# EAGLE board Копия keyBoard_B (EAGLE 6.3), part 1 of 2
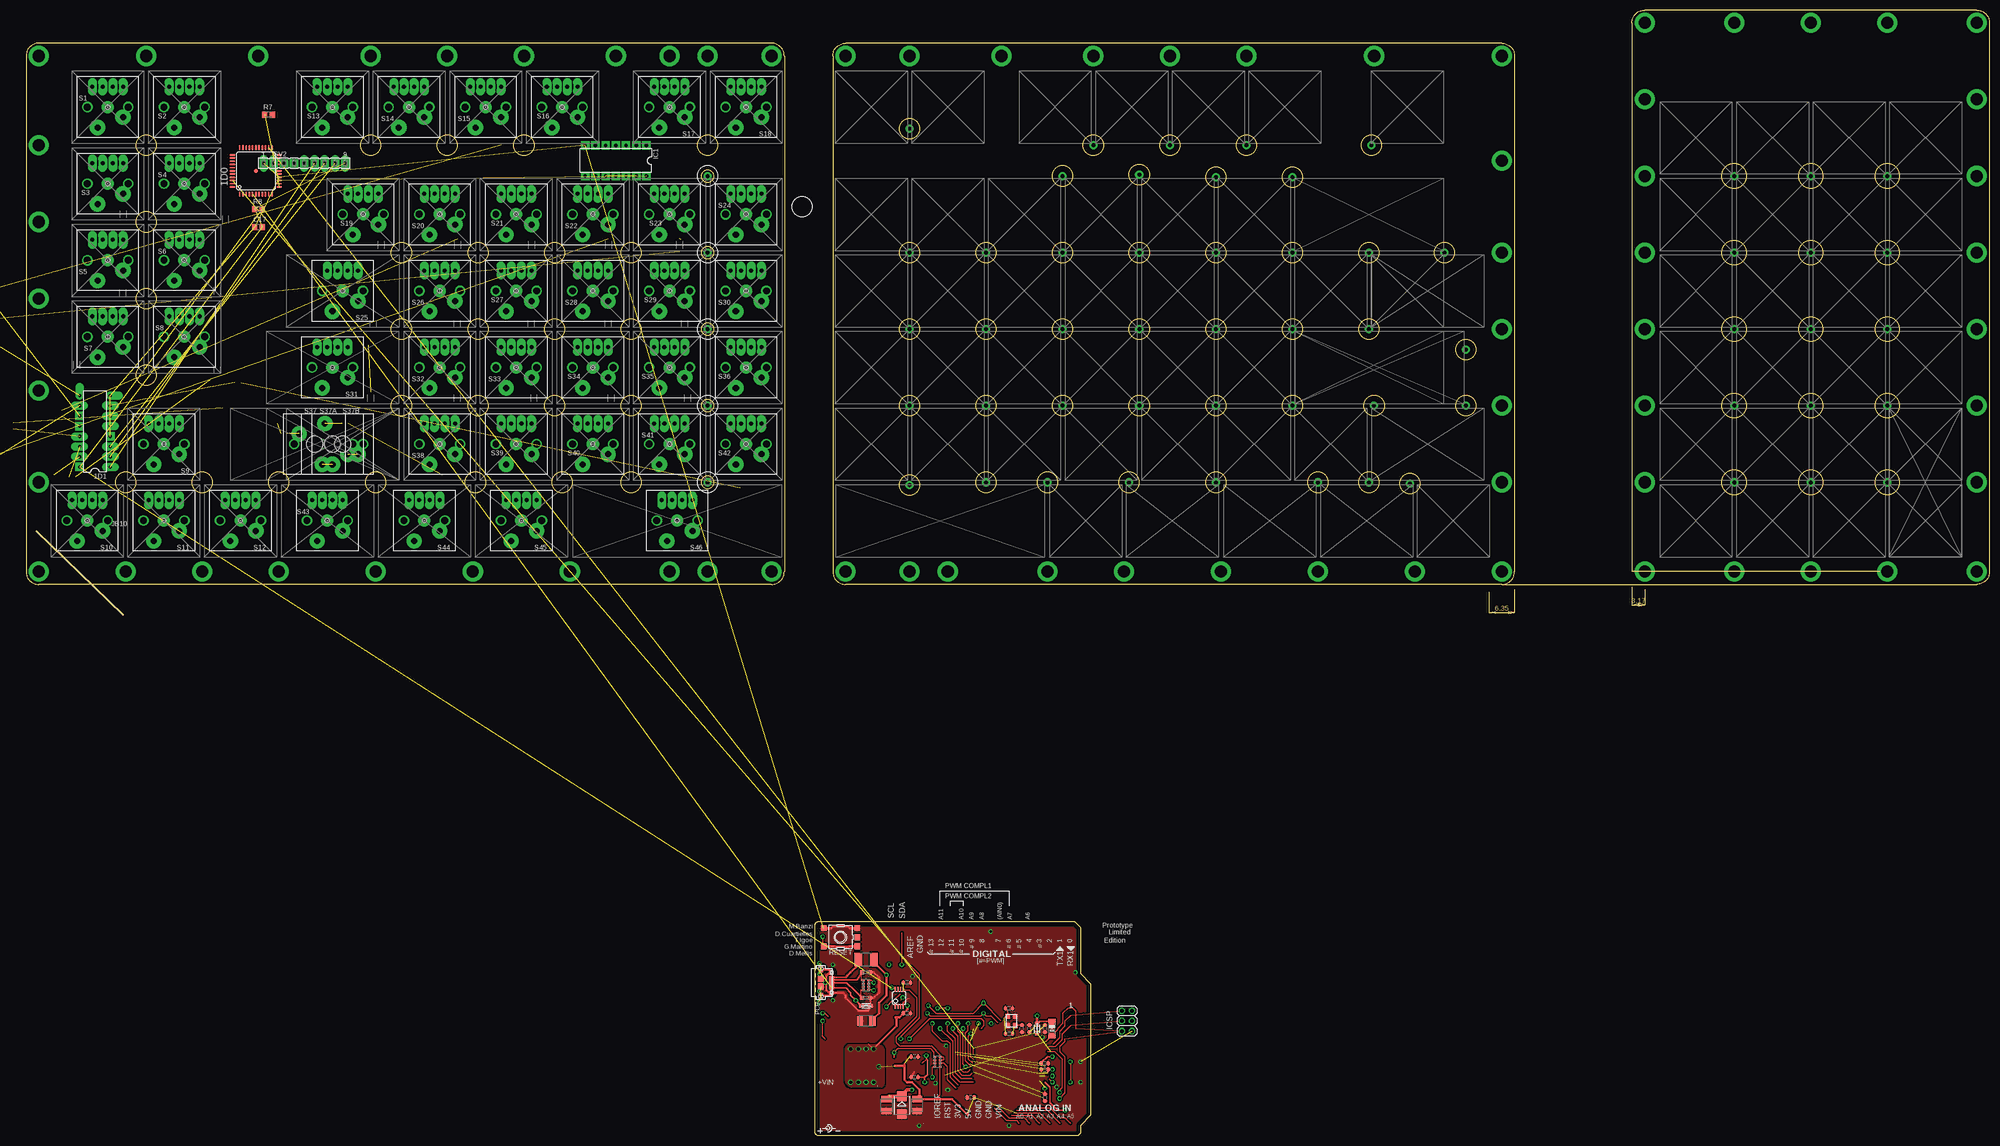
[diagram p3: board, top side]
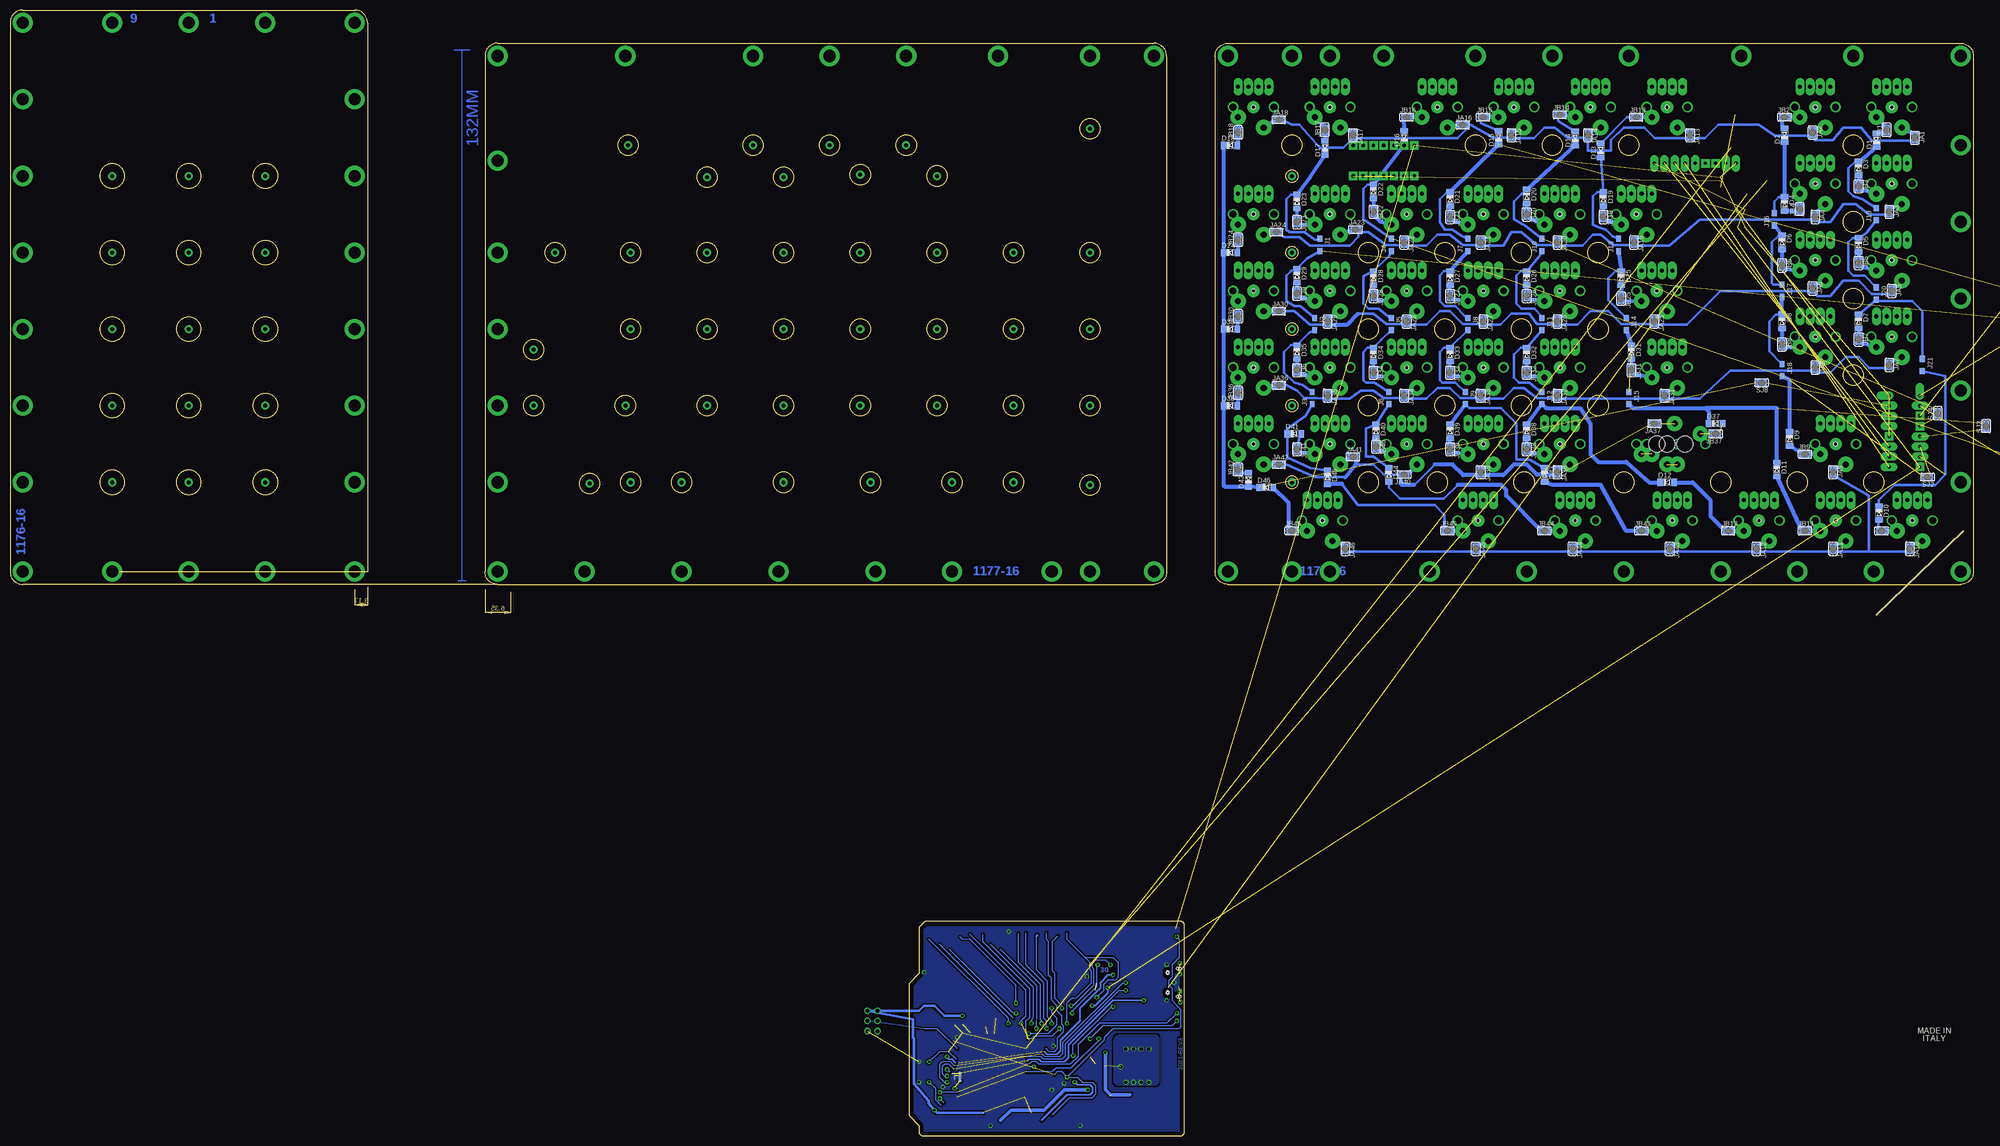
[diagram p4: board, bottom side, seen from below]

Size 488.31 x 280.04 mm. Coordinates in mm from the lower left corner, seen from the top.
Outline: 2.54,150.5 24.13,129.54
Outline: 367.03,137.16 485.14,137.16 arc90 488.31,140.34 488.31,276.86 arc90 485.14,280.04 402.59,280.04 arc90 399.42,276.86 399.42,140.34 461.01,140.34
Outline: 367.03,137.16 203.84,137.16 arc-90 200.66,140.34 200.66,268.61 arc-90 203.84,271.78 367.03,271.78 arc-90 370.2,268.61 370.2,140.34 arc-90 367.03,137.16
Outline: 188.59,268.61 188.59,140.34 arc-90 185.42,137.16 3.17,137.16 arc-90 0,140.34 0,268.61 arc-90 3.17,271.78 185.42,271.78 arc-90 188.59,268.61
Outline: 260.73,53.34 262.25,51.82 262.25,40.39 264.8,37.85 264.8,5.08 262.25,2.54 262.25,1 arc-90 261.25,0 197.22,0 arc-90 196.22,1 196.22,52.34 arc-90 197.22,53.34 260.73,53.34
Outline: circle at 462.92,162.56 radius 3
Outline: circle at 462.92,238.76 radius 3
Outline: circle at 424.81,181.61 radius 3
Outline: circle at 443.87,181.61 radius 3
Outline: circle at 443.87,162.56 radius 3
Outline: circle at 424.81,162.56 radius 3
Outline: circle at 424.81,200.66 radius 3
Outline: circle at 424.81,219.71 radius 3
Outline: circle at 462.92,181.61 radius 3
Outline: circle at 462.92,200.66 radius 3
Outline: circle at 462.92,219.71 radius 3
Outline: circle at 443.87,219.71 radius 3
Outline: circle at 443.87,238.76 radius 3
Outline: circle at 424.81,238.76 radius 3
Outline: circle at 443.87,200.66 radius 3
Outline: circle at 219.71,219.71 radius 2.5
Outline: circle at 238.76,219.71 radius 2.5
Outline: circle at 257.81,219.71 radius 2.5
Outline: circle at 219.71,200.66 radius 2.5
Outline: circle at 238.76,200.66 radius 2.5
Copper layers (1*16): Top 0.035mm / dielectric 1.5mm / Bottom 0.035mm
Design rules "default": minimum track width 10mil, minimum drill 24mil, track to track 8mil, track to pad 8mil, pad to pad 8mil, via to via 8mil, smd to smd 8mil, copper to edge 40mil, drill to drill 8mil, minimum pad ring 10mil, minimum via ring 8mil, stop-mask expansion 4mil, vias tented up to drill 0mil, thermal gap 10mil
Net classes: 0 default: width 0.254 mm, drill 0.61 mm, clearance 0.254 mm; 1 power: width 0.254 mm, drill 0.61 mm, clearance 0.254 mm; 2 gnd: width 0.254 mm, drill 0.61 mm, clearance 0.254 mm; 3 usbvcc: width 0.254 mm, drill 0.61 mm, clearance 0.254 mm; 4 aref: width 0.254 mm, drill 0.61 mm, clearance 0.254 mm
vRestrict: area 238.8,38.6 to 239.3,38.9; area 232,35.2 to 232.7,35.7; area 240.7,35.2 to 241.4,35.7; area 237.5,35.2 to 238,35.7; area 244.1,10.3 to 244.7,10.8; area 246.6,10.2 to 247.1,11

## Footprints (pad centres in the part's own frame; a part is rotated, then mirrored left to right if it is on the bottom)
SMARTPRJ_TQFP44-PAD = smd 1.4 x 0.45: 1 -5.8,4; 2 -5.8,3.2; 3 -5.8,2.4; 4 -5.8,1.6; 5 -5.8,0.8; 6 -5.8,0; 7 -5.8,-0.8; 8 -5.8,-1.6; 9 -5.8,-2.4; 10 -5.8,-3.2; 11 -5.8,-4; 23 5.8,-4; 24 5.8,-3.2; 25 5.8,-2.4; 26 5.8,-1.6; 27 5.8,-0.8; 28 5.8,0; 29 5.8,0.8; 30 5.8,1.6; 31 5.8,2.4; 32 5.8,3.2; 33 5.8,4 | smd 0.45 x 1.4: 12 -4,-5.8; 13 -3.2,-5.8; 14 -2.4,-5.8; 15 -1.6,-5.8; 16 -0.8,-5.8; 17 0,-5.8; 18 0.8,-5.8; 19 1.6,-5.8; 20 2.4,-5.8; 21 3.2,-5.8; 22 4,-5.8; 34 4,5.8; 35 3.2,5.8; 36 2.4,5.8; 37 1.6,5.8; 38 0.8,5.8; 39 0,5.8; 40 -0.8,5.8; 41 -1.6,5.8; 42 -2.4,5.8; 43 -3.2,5.8; 44 -4,5.8 | smd 1 x 1: P$1 0,0
DIL16 = drill 0.813 pad 2.1 long: 1 -8.89,-3.81; 2 -6.35,-3.81; 3 -3.81,-3.81; 5 1.27,-3.81; 6 3.81,-3.81; 7 6.35,-3.81; 10 6.35,3.81; 13 -1.27,3.81; 14 -3.81,3.81; 15 -6.35,3.81 | drill 0.813 pad 2.1 square: 4 -1.27,-3.81; 11 3.81,3.81; 12 1.27,3.81; 16 -8.89,3.81 | drill 0.813 pad 2.1 offset: 8 8.89,-3.81; 9 8.89,3.81
C0603-ROUND = smd 0.898 x 1.1: 1 -0.889,0; 2 0.889,0
SMC_B = smd 1.6 x 2.4: + -1.5,0; - 1.5,0
C0805 = smd 1.3 x 1.5: 1 -0.95,0; 2 0.95,0
SOD80C = smd 1.4 x 1.8 bottom: A -1.7,0; C 1.7,0
SMB = smd 2.4 x 2.4: A 2.2,0; C -2.2,0
MINIMELF = smd 1.4 x 1.8: A 1.7,0; C -1.7,0
L1812 = smd 1.9 x 3.4: 1 -1.95,0; 2 1.95,0
DIL14 = drill 0.813 pad 2.1 square: 1 -7.62,-3.81; 2 -5.08,-3.81; 3 -2.54,-3.81; 4 0,-3.81; 5 2.54,-3.81; 6 5.08,-3.81; 7 7.62,-3.81; 8 7.62,3.81; 9 5.08,3.81; 10 2.54,3.81; 11 0,3.81; 12 -2.54,3.81; 13 -5.08,3.81; 14 -7.62,3.81
MSOP08 = smd 0.3 x 1.2: 1 -0.976,-2.113; 2 -0.326,-2.113; 3 0.324,-2.113; 4 0.974,-2.113; 5 0.974,2.112; 6 0.324,2.112; 7 -0.326,2.112; 8 -0.976,2.112
2X03 = drill 0.95 pad 1.55 octagon: 1 -2.54,-1.27; 2 -2.54,1.27; 3 0,-1.27; 4 0,1.27; 5 2.54,-1.27; 6 2.54,1.27
R1206W = smd 1.5 x 1.2 bottom: 1 1.499,0; 2 -1.499,0
CON2_USB_MICRO_B_AT = smd 0.406 x 1.346: P1 -1.321,2.692; P2 -0.66,2.692; P3 0,2.692; P4 0.66,2.692; P5 1.321,2.692 | smd 1.651 x 1.549: S1 -3.302,0; S2 3.302,0 | smd 1.524 x 1.016: S3 -2.489,2.692; S4 2.489,2.692 | smd 1.524 x 1.524: S5 -1.016,0; S6 1.016,0 | hole 0.7: -3.505,0.254; -3.505,-0.254; 3.505,0.254; 3.505,-0.254; -2.616,2.692; -2.362,2.692; 2.362,2.692; 2.616,2.692
SJ = smd 1.168 x 1.6 bottom: 1 0.762,0; 2 -0.762,0
SJ' = smd 1.168 x 1.6: 1 -0.762,0; 2 0.762,0
0805 = smd 1.2 x 1: 1 -1.1,0; 2 1.1,0
R0603-ROUND = smd 0.898 x 1.1: 1 -0.889,0; 2 0.889,0
R0402 = smd 0.7 x 0.9: 1 -0.65,0; 2 0.65,0
M0805 = smd 1.3 x 1.6: 1 -0.95,0; 2 0.95,0
TS42 = smd 1.6 x 1.4: 1 -4.2,2.25; 2 4.2,2.25; 3 -4.2,-2.25; 4 4.2,-2.25; 5 -4.2,0
CAY16 = smd 0.5 x 0.65: 1 -1.2,-0.675; 2 -0.4,-0.675; 3 0.4,-0.675; 4 1.2,-0.675; 5 1.2,0.675; 6 0.4,0.675; 7 -0.4,0.675; 8 -1.2,0.675
CHERRY-MX-4P = drill 1.016 pad 2.184 long: D1 -3.81,-5.08; D2 3.81,-5.08; LED1 -1.27,-5.08; LED2 1.27,-5.08 | drill 1 pad 3: P$1 0,0 | drill 1.714 pad 1.93: P$3 -5.08,0; P$4 5.08,0 | drill 1.5 pad 3.81: SW1 -3.81,2.54; SW2 2.54,5.08 | hole 1: 0,0
CHERRY-MX = drill 0.8: P$1 0,0 | drill 1.714 pad 1.93: P$3 -5.08,0; P$4 5.08,0 | drill 1.5 pad 3.81: SW1 -3.81,2.54; SW2 2.54,5.08 | hole 4: 0,0
FE09 = drill 0.813 pad 2.1 long: 1 -10.16,0; 2 -7.62,0; 5 0,0; 6 2.54,0; 7 5.08,0; 8 7.62,0; 9 10.16,0 | drill 0.813 pad 2.1 square: 3 -5.08,0; 4 -2.54,0
SMARTPRJ_CRYSTAL-3.2-2.5 = smd 1.3 x 1.05: 1 -1.15,-0.925; 2 1.15,-0.925; 3 1.15,0.925; 4 -1.15,0.925
CRYSTAL-3.2-2.5 = smd 1.3 x 1.05: 1 -1.15,-0.925; 2 1.15,-0.925; 3 1.15,0.925; 4 -1.15,0.925
CT/CN0603 = smd 1 x 1: 1 -1,0; 2 1,0

## Placement (x,y rotation side)
1D0  ATMEGA32U4  [SMARTPRJ_TQFP44-PAD]  57.15,240.03 90 top
1D1  74HC138N  [DIL16]  17.14,175.26 90 top
C3  100n  [C0603-ROUND]  249.56,26.67 90 top
C4  100n  [C0603-ROUND]  234.95,9.53 180 top
C5  1uF  [C0603-ROUND]  253.37,26.67 270 top
C6  100n  [C0603-ROUND]  253.37,9.53 270 top
C7  1uF  [C0603-ROUND]  253.37,16.51 0 top
C8  10u  [SMC_B]  208.91,28.57 180 top
C9  100n  [C0603-ROUND]  253.37,18.03 180 top
C10  10u  [SMC_B]  214,7.62 270 top
C11  1u  [C0603-ROUND]  220.98,19.69 180 top
C12  10u  [SMC_B]  221.62,7.62 270 top
C13  100n  [C0603-ROUND]  219.07,30.48 0 top
C14  1u  [C0603-ROUND]  220.98,14.61 0 top
C15  22p  [C0603-ROUND]  247.65,26.67 90 top
C16  22p  [C0603-ROUND]  244.47,31.75 0 top
C17  100n  [C0805]  57.78,226.06 0 top
C22  100n  [C0603-ROUND]  219.07,38.1 180 top
D1  LL4148  [SOD80C]  24.13,247.65 270 top
D2  LL4148  [SOD80C]  46.99,248.92 270 top
D3  LL4148  [SOD80C]  28.57,240.67 90 top
D4  LL4148  [SOD80C]  46.99,231.78 90 top
D5  LL4148  [SOD80C]  28.57,221.62 90 top
D6  LL4148  [SOD80C]  47.62,222.25 90 top
D7  LL4148  [SOD80C]  28.57,202.56 90 top
D8  LL4148  [SOD80C]  47.62,202.56 90 top
D9  LL4148  [SOD80C]  45.72,173.36 90 top
D10  LL4148  [SOD80C]  23.5,154.94 90 top
D11  LL4148  [SOD80C]  48.9,165.74 90 top
D12  LL4148  [SOD80C]  76.2,162.56 0 top
D13  LL4148  [SOD80C]  92.71,245.11 270 top
D14  LL4148  [SOD80C]  99.06,248.12 270 top
D15  LL4148  [SOD80C]  118.11,248.29 270 top
D16  LL4148  [SOD80C]  141.6,248.29 270 top
D17  LL4148  [SOD80C]  161.29,245.75 270 top
D18  LL4148  [SOD80C]  184.78,246.38 0 top
D19  LL4148  [SOD80C]  92.08,233.05 90 top
D20  LL4148  [SOD80C]  111.12,233.68 90 top
D21  LL4148  [SOD80C]  130.18,233.05 90 top
D22  LL4148  [SOD80C]  149.22,234.95 90 top
D23  LL4148  [SOD80C]  168.28,232.41 90 top
D24  LL4148  [SOD80C]  184.78,219.71 0 top
D25  LL4148  [SOD80C]  87.63,213.36 90 top
D26  LL4148  [SOD80C]  111.12,213.36 90 top
D27  LL4148  [SOD80C]  130.18,213.36 90 top
D28  LL4148  [SOD80C]  149.22,213.36 90 top
D29  LL4148  [SOD80C]  168.28,214 90 top
D30  LL4148  [SOD80C]  184.78,200.66 0 top
D31  LL4148  [SOD80C]  85.09,194.94 90 top
D32  LL4148  [SOD80C]  111.12,194.31 90 top
D33  LL4148  [SOD80C]  130.18,194.31 90 top
D34  LL4148  [SOD80C]  149.22,194.31 90 top
D35  LL4148  [SOD80C]  168.28,194.94 90 top
D36  LL4148  [SOD80C]  184.78,181.61 0 top
D37  LL4148  [SOD80C]  64.14,177.17 0 top
D38  LL4148  [SOD80C]  111.12,175.26 90 top
D39  LL4148  [SOD80C]  130.18,175.26 90 top
D40  LL4148  [SOD80C]  148.59,175.26 90 top
D41  LL4148  [SOD80C]  168.91,174.62 0 top
D42  LL4148  [SOD80C]  180.34,163.19 270 top
D43  LL4148  [SOD80C]  106.68,164.47 90 top
D44  LL4148  [SOD80C]  145.41,164.47 90 top
D45  LL4148  [SOD80C]  160.66,163.83 90 top
D46  LL4148  [SOD80C]  175.9,161.29 0 top
D90  M7  [SMB]  217.81,7.62 270 top
D91  CD1206-S01575  [MINIMELF]  255.14,26.67 270 top
F1  MF-MSMF050-2 500mA  [L1812]  208.91,43.81 180 top
IC1  74ACT04N  [DIL14]  146.69,242.57 180 top
IC2  LMV358IDGKR  [MSOP08]  217.17,34.29 0 top
ICSP  ICSP  [2X03]  273.81,28.57 270 top
J1  J  [R1206W]  162.56,221.62 90 top
J2  J  [R1206W]  163.83,201.93 90 top
J3  J  [R1206W]  164.47,183.52 270 top
J4  J  [R1206W]  144.78,221.62 270 top
J5  J  [R1206W]  144.78,201.93 90 top
J6  J  [R1206W]  145.41,183.52 270 top
J7  J  [R1206W]  125.73,221.62 270 top
J8  J  [R1206W]  125.73,201.93 90 top
J9  J  [R1206W]  126.36,183.52 90 top
J10  J  [R1206W]  107.31,221.62 270 top
J11  J  [R1206W]  107.31,201.93 90 top
J12  J  [R1206W]  107.31,183.52 90 top
J13  J  [R1206W]  88.27,221.62 270 top
J14  J  [R1206W]  86.36,201.93 90 top
J15  J  [R1206W]  85.72,183.52 90 top
J16  J  [R1206W]  49.53,227.97 270 top
J17  J  [R1206W]  47.62,210.19 90 top
J18  J  [R1206W]  47.62,190.5 90 top
J19  J  [R1206W]  24.13,229.24 270 top
J20  J  [R1206W]  24.13,209.55 90 top
J21  J  [R1206W]  12.7,191.77 90 top
J47  USB MICRO  [CON2_USB_MICRO_B_AT]  197.66,38.1 270 top
JA1  [SJ]  14.61,248.29 90 top
JA2  [SJ]  40.01,249.56 90 top
JA3  [SJ]  20.95,229.87 90 top
JA4  [SJ]  39.37,228.6 90 top
JA5  [SJ]  20.32,210.19 90 top
JA6  [SJ]  40.01,210.82 90 top
JA7  [SJ]  20.95,191.77 90 top
JA8  [SJ]  39.37,191.13 90 top
JA9  [SJ]  34.92,165.1 90 top
JA10  [SJ]  15.88,146.05 90 top
JA11  [SJ]  34.92,146.05 90 top
JA12  [SJ]  53.98,146.05 90 top
JA13  [SJ]  70.48,248.92 90 top
JA14  [SJ]  95.89,248.92 90 top
JA15  [SJ]  114.94,248.92 90 top
JA16  [SJ]  127,251.46 0 top
JA17  [SJ]  154.31,248.92 90 top
JA18  [SJ]  172.72,252.73 0 top
JA19  [SJ]  84.45,222.25 90 top
JA20  [SJ]  103.5,222.25 90 top
JA21  [SJ]  122.56,222.25 90 top
JA22  [SJ]  141.6,222.25 90 top
JA23  [SJ]  153.67,225.43 0 top
JA24  [SJ]  173.35,224.79 0 top
JA25  [SJ]  79.38,202.56 90 top
JA26  [SJ]  103.5,202.56 90 top
JA27  [SJ]  121.92,202.56 90 top
JA28  [SJ]  140.97,202.56 90 top
JA29  [SJ]  160.66,202.56 90 top
JA30  [SJ]  172.72,205.11 0 top
JA31  [SJ]  76.83,184.15 90 top
JA32  [SJ]  103.5,184.15 90 top
JA33  [SJ]  122.56,184.15 90 top
JA34  [SJ]  141.6,184.15 90 top
JA35  [SJ]  160.66,184.15 90 top
JA36  [SJ]  172.72,186.69 0 top
JA37  [SJ]  79.38,177.17 180 top
JA38  [SJ]  103.5,165.1 90 top
JA39  [SJ]  122.56,165.1 90 top
JA40  [SJ]  141.6,164.47 180 top
JA41  [SJ]  154.31,168.91 0 top
JA42  [SJ]  172.72,167 0 top
JA43  [SJ]  75.56,146.05 90 top
JA44  [SJ]  99.69,146.05 90 top
JA45  [SJ]  123.83,146.05 90 top
JA46  [SJ]  156.21,146.05 90 top
JB1  [SJ]  21.59,250.19 270 top
JB2  [SJ']  46.99,253.37 0 bottom
JB3  [SJ]  28.57,236.22 90 top
JB4  [SJ]  43.18,230.5 270 top
JB5  [SJ']  28.57,217.17 270 bottom
JB6  [SJ]  47.62,216.54 90 top
JB7  [SJ]  28.57,198.12 90 top
JB8  [SJ]  47.62,196.85 90 top
JB9  [SJ]  41.91,169.55 0 top
JB10  [SJ]  22.86,150.5 0 top
JB11  [SJ]  41.91,150.5 0 top
JB12  [SJ]  60.96,150.5 0 top
JB13  [SJ]  83.82,253.37 0 top
JB14  [SJ']  102.87,254 0 bottom
JB15  [SJ']  121.92,253.37 0 bottom
JB16  [SJ']  140.97,253.37 0 bottom
JB17  [SJ]  161.29,250.19 270 top
JB18  [SJ]  182.88,249.56 270 top
JB19  [SJ]  92.08,228.6 90 top
JB20  [SJ]  111.12,229.24 90 top
JB21  [SJ]  130.18,228.6 90 top
JB22  [SJ]  149.22,229.87 90 top
JB23  [SJ]  168.28,227.33 90 top
JB24  [SJ]  182.88,222.88 270 top
JB25  [SJ]  87.63,208.28 90 top
JB26  [SJ]  111.12,208.92 90 top
JB27  [SJ]  130.18,208.92 90 top
JB28  [SJ]  149.22,208.92 90 top
JB29  [SJ]  168.28,209.55 90 top
JB30  [SJ]  182.88,203.84 270 top
JB31  [SJ]  85.09,190.5 90 top
JB32  [SJ]  111.12,189.87 90 top
JB33  [SJ]  130.18,189.87 90 top
JB34  [SJ]  149.22,189.87 90 top
JB35  [SJ]  168.28,190.5 90 top
JB36  [SJ]  182.88,184.79 270 top
JB37  [SJ]  64.14,174.62 180 top
JB38  [SJ]  111.12,170.81 90 top
JB39  [SJ]  130.18,170.81 90 top
JB40  [SJ]  148.59,171.45 90 top
JB41  [SJ]  168.28,170.81 90 top
JB42  [SJ]  182.88,165.74 270 top
JB43  [SJ]  82.55,150.5 0 top
JB44  [SJ]  106.68,150.5 0 top
JB45  [SJ]  130.81,150.5 0 top
JB46  [SJ]  169.54,150.5 0 top
L1  MH2029-300Y  [0805]  251.46,26.67 270 top
L2  MH2029-300Y  [0805]  208.91,32.38 0 top
R4  1M  [R0603-ROUND]  244.47,25.4 0 top
R5  NM  [R0402]  252.09,14.33 90 bottom
R6  NM  [R0402]  252.09,14.96 90 bottom
R7  [M0805]  60.33,254 0 top
R8  [M0805]  57.78,230.5 0 top
RESET  TS42  [TS42]  202.56,49.4 180 top
RN1  10K  [CAY16]  226.69,18.42 270 top
RN3  22R  [CAY16]  208.91,37.47 90 top
S1  Scroll Lock  [CHERRY-MX-4P]  20.32,255.91 180 top
S2  ESC  [CHERRY-MX-4P]  39.37,255.91 180 top
S3  Ins  [CHERRY-MX-4P]  20.32,236.86 180 top
S4  Pause  [CHERRY-MX-4P]  39.37,236.86 180 top
S5  Home  [CHERRY-MX-4P]  20.32,217.81 180 top
S6  PageUp  [CHERRY-MX-4P]  39.37,217.81 180 top
S7  End  [CHERRY-MX-4P]  20.32,198.75 180 top
S8  PageDown  [CHERRY-MX-4P]  39.37,198.75 180 top
S9  Up  [CHERRY-MX-4P]  34.29,172.09 180 top
S10  Left  [CHERRY-MX-4P]  15.24,153.04 180 top
S11  Down  [CHERRY-MX-4P]  34.29,153.04 180 top
S12  Right  [CHERRY-MX-4P]  53.34,153.04 180 top
S13  F1  [CHERRY-MX-4P]  76.2,255.91 180 top
S14  F2  [CHERRY-MX-4P]  95.25,255.91 180 top
S15  F3  [CHERRY-MX-4P]  114.3,255.91 180 top
S16  F4  [CHERRY-MX-4P]  133.35,255.91 180 top
S17  F5  [CHERRY-MX-4P]  160.02,255.91 180 top
S18  F6  [CHERRY-MX-4P]  179.07,255.91 180 top
S19  1  [CHERRY-MX-4P]  83.82,229.24 180 top
S20  2  [CHERRY-MX-4P]  102.87,229.24 180 top
S21  3  [CHERRY-MX-4P]  121.92,229.24 180 top
S22  4  [CHERRY-MX-4P]  140.97,229.24 180 top
S23  5  [CHERRY-MX-4P]  160.02,229.24 180 top
S24  6  [CHERRY-MX-4P]  179.07,229.24 180 top
S25  TAB  [CHERRY-MX-4P]  78.74,210.19 180 top
S26  Q  [CHERRY-MX-4P]  102.87,210.19 180 top
S27  W  [CHERRY-MX-4P]  121.92,210.19 180 top
S28  E  [CHERRY-MX-4P]  140.97,210.19 180 top
S29  R  [CHERRY-MX-4P]  160.02,210.19 180 top
S30  T  [CHERRY-MX-4P]  179.07,210.19 180 top
S31  LCtrl  [CHERRY-MX-4P]  76.2,191.13 180 top
S32  A  [CHERRY-MX-4P]  102.87,191.13 180 top
S33  S  [CHERRY-MX-4P]  121.92,191.13 180 top
S34  D  [CHERRY-MX-4P]  140.97,191.13 180 top
S35  F  [CHERRY-MX-4P]  160.02,191.13 180 top
S36  G  [CHERRY-MX-4P]  179.07,191.13 180 top
S37  L Shift  [CHERRY-MX]  71.75,172.09 0 top
S37A  L Shift  [CHERRY-MX]  76.2,172.09 180 top
S37B  L Shift  [CHERRY-MX]  78.74,172.09 180 top
S38  Z  [CHERRY-MX-4P]  102.87,172.09 180 top
S39  X  [CHERRY-MX-4P]  121.92,172.09 180 top
S40  C  [CHERRY-MX-4P]  140.97,172.09 180 top
S41  V  [CHERRY-MX-4P]  160.02,172.09 180 top
S42  B  [CHERRY-MX-4P]  179.07,172.09 180 top
S43  Caps Lock  [CHERRY-MX-4P]  74.93,153.04 180 top
S44  Alt  [CHERRY-MX-4P]  99.06,153.04 180 top
S45  F1  [CHERRY-MX-4P]  123.19,153.04 180 top
S46  Space  [CHERRY-MX-4P]  161.93,153.04 180 top
SJ2  [SJ]  11.43,163.83 180 top
SJ3  [SJ]  -3.17,176.53 270 top  (outside the outline)
SJ4  [SJ]  8.89,179.71 270 top
SJ5  [SJ]  -9.53,209.55 270 top  (outside the outline)
SJ6  [SJ]  -10.79,167.64 270 top  (outside the outline)
SJ7  [SJ]  -14.61,201.93 270 top  (outside the outline)
SJ8  [SJ]  52.7,187.32 180 top
SV2  CON_KB_N  [FE09]  69.22,241.94 0 top
U$1  [18X18]  19.05,257.18 0 top
U$2  [18X18]  38.1,257.18 0 top
U$3  [18X18]  19.05,238.12 0 top
U$4  [18X18]  19.05,219.07 0 top
U$5  [18X18]  38.1,238.12 0 top
U$6  [18X18]  19.05,200.03 0 top
U$7  [18X18]  38.1,219.07 0 top
U$8  [18X18]  38.1,200.03 0 top
U$9  [18X18]  52.07,154.31 0 top
U$10  [18X18]  33.02,151.77 90 top
U$11  [18X18]  33.02,170.81 90 top
U$12  [18X18]  120.65,170.81 90 top
U$13  [18X18]  13.97,151.77 90 top
U$15  [18X23]  99.06,153.04 0 top
U$16  [18X23]  123.19,153.04 0 top
U$17  [18X52]  161.93,153.04 0 top
U$18  [18X18]  101.6,173.36 0 top
U$19  [18X18]  177.8,173.36 0 top
U$20  [18X18]  158.75,173.36 0 top
U$21  [18X18]  139.7,173.36 0 top
U$22  [18X42]  71.75,172.09 0 top
U$23  [18X18]  120.65,189.87 90 top
U$24  [18X18]  101.6,192.41 0 top
U$25  [18X18]  177.8,192.41 0 top
U$26  [18X18]  158.75,192.41 0 top
U$27  [18X18]  139.7,192.41 0 top
U$28  [18X33]  76.2,191.13 0 top
U$29  [18X18]  120.65,208.92 90 top
U$30  [18X18]  101.6,211.46 0 top
U$31  [18X18]  177.8,211.46 0 top
U$32  [18X18]  158.75,211.46 0 top
U$33  [18X18]  139.7,211.46 0 top
U$34  [18X28]  78.74,210.19 0 top
U$35  [18X18]  120.65,227.97 90 top
U$36  [18X18]  101.6,230.5 0 top
U$37  [18X18]  177.8,230.5 0 top
U$38  [18X18]  158.75,230.5 0 top
U$39  [18X18]  139.7,230.5 0 top
U$40  [18X18]  82.55,230.5 0 top
U$41  [18X18]  177.8,257.18 0 top
U$42  [18X18]  158.75,257.18 0 top
U$43  [18X18]  113.03,257.18 0 top
U$44  [18X18]  132.08,257.18 0 top
U$45  [18X18]  93.98,257.18 0 top
U$46  [18X18]  74.93,257.18 0 top
U$81  [18X18]  414.02,249.56 0 top
U$82  [18X18]  433.07,249.56 0 top
U$88  [18X18]  208.91,257.18 0 top
U$91  [18X23]  74.93,153.04 0 top
U$93  [18X18]  227.97,257.18 0 top
U$94  [18X18]  292.74,257.18 0 top
U$95  [18X18]  254.63,257.18 0 top
U$96  [18X18]  273.69,257.18 0 top
U$97  [18X18]  311.79,257.18 0 top
U$98  [18X18]  208.91,230.5 0 top
U$99  [18X18]  227.97,230.5 0 top
U$100  [18X18]  247.01,230.5 0 top
U$101  [18X18]  266.06,230.5 0 top
U$102  [18X18]  285.12,230.5 0 top
U$103  [18X18]  304.17,230.5 0 top
U$104  [18X18]  208.91,211.46 0 top
U$105  [18X18]  227.97,211.46 0 top
U$106  [18X18]  247.01,211.46 0 top
U$107  [18X18]  266.06,211.46 0 top
U$108  [18X18]  285.12,211.46 0 top
U$109  [18X18]  304.17,211.46 0 top
U$110  [18X18]  323.21,211.46 0 top
U$111  [18X18]  342.26,211.46 0 top
U$113  [18X18]  208.91,192.41 0 top
U$114  [18X33]  76.2,172.09 0 top
U$115  [18X28]  78.74,172.09 0 top
U$119  [18X18]  452.12,249.56 0 top
U$120  [18X18]  471.17,249.56 0 top
U$121  [18X18]  471.17,230.5 0 top
U$122  [18X18]  452.12,230.5 0 top
U$123  [18X18]  433.07,230.5 0 top
U$124  [18X18]  414.02,230.5 0 top
U$125  [18X18]  414.02,211.46 0 top
U$126  [18X18]  433.07,211.46 0 top
U$127  [18X18]  452.12,211.46 0 top
U$128  [18X18]  471.17,211.46 0 top
U$129  [18X18]  414.02,192.41 0 top
U$130  [18X18]  433.07,192.41 0 top
U$131  [18X18]  452.12,192.41 0 top
U$132  [18X18]  471.17,192.41 0 top
U$133  [18X18]  414.02,173.36 0 top
U$134  [18X18]  433.07,173.36 0 top
U$135  [18X18]  452.12,173.36 0 top
U$136  [18X18]  471.17,173.36 0 top
U$137  [18X18]  414.02,154.31 0 top
U$138  [18X18]  433.07,154.31 0 top
U$139  [18X18]  452.12,154.31 0 top
U$140  [37X18]  472.44,162.56 0 top
U$141  [18X18]  471.17,154.31 0 top
U$142  [KEY]  455.93,172.09 0 top
U$143  [KEY]  455.93,153.04 0 top
U$144  [KEY]  436.88,172.09 0 top
U$145  [KEY]  436.88,153.04 0 top
U$146  [KEY]  417.83,153.04 0 top
U$147  [KEY]  417.83,172.09 0 top
U$148  [KEY]  455.93,191.13 0 top
U$149  [NUMENTER]  474.98,162.56 0 top
U$150  [KEY]  436.88,191.13 0 top
U$151  [KEY]  417.83,191.13 0 top
U$152  [KEY]  474.98,191.13 0 top
U$153  [KEY]  474.98,210.19 0 top
U$154  [KEY]  455.93,210.19 0 top
U$155  [KEY]  436.88,210.19 0 top
U$156  [KEY]  417.83,210.19 0 top
U$157  [KEY]  417.83,229.24 0 top
U$158  [KEY]  436.88,229.24 0 top
U$159  [KEY]  455.93,229.24 0 top
U$160  [KEY]  474.98,229.24 0 top
U$161  [KEY]  474.98,248.29 0 top
U$162  [KEY]  455.93,248.29 0 top
U$163  [KEY]  436.88,248.29 0 top
U$164  [KEY]  417.83,248.29 0 top
U$166  [18X18]  227.97,192.41 0 top
U$167  [18X18]  247.01,192.41 0 top
U$168  [18X18]  266.06,192.41 0 top
U$169  [18X18]  285.12,192.41 0 top
U$170  [18X18]  304.17,192.41 0 top
U$171  [18X18]  208.91,173.36 0 top
U$172  [18X18]  227.97,173.36 0 top
U$173  [18X18]  247.01,173.36 0 top
U$174  [18X18]  266.06,173.36 0 top
U$175  [18X18]  285.12,173.36 0 top
U$176  [18X18]  304.17,173.36 0 top
U$177  [18X52]  227.33,153.04 0 top
U$178  [18X37]  334.01,229.24 0 top
U$179  [18X18]  353.69,154.31 0 top
U$180  [18X23]  333.38,153.04 0 top
U$181  [18X23]  309.25,153.04 0 top
U$182  [18X23]  285.12,153.04 0 top
U$183  [18X37]  334.01,191.13 0 top
U$184  [18X18]  342.26,257.18 0 top
U$185  [18X18]  323.21,173.36 0 top
U$186  [SIZE132]  375.92,206.06 0 top
U$187  [18X42]  336.55,191.13 0 top
U$188  [18X18]  262.25,154.31 0 top
U$189  [18X28]  348.62,172.09 0 top
U$190  [18X28]  348.62,210.19 0 top
X1  16mhz  [SMARTPRJ_CRYSTAL-3.2-2.5]  51.44,336.55 0 top  (outside the outline)
Y1  16MHz KX-7  [CRYSTAL-3.2-2.5]  245.11,28.57 270 top
Z1  CG0603MLC-05E  [CT/CN0603]  208.91,34.29 0 top
Z2  CG0603MLC-05E  [CT/CN0603]  208.91,40.64 0 top